# Altium schematic sheet CONNECTOR.SchDoc
size 420 x 297 mm; DocumentNumber: 3; SheetNumber: 3; SheetTotal: 17
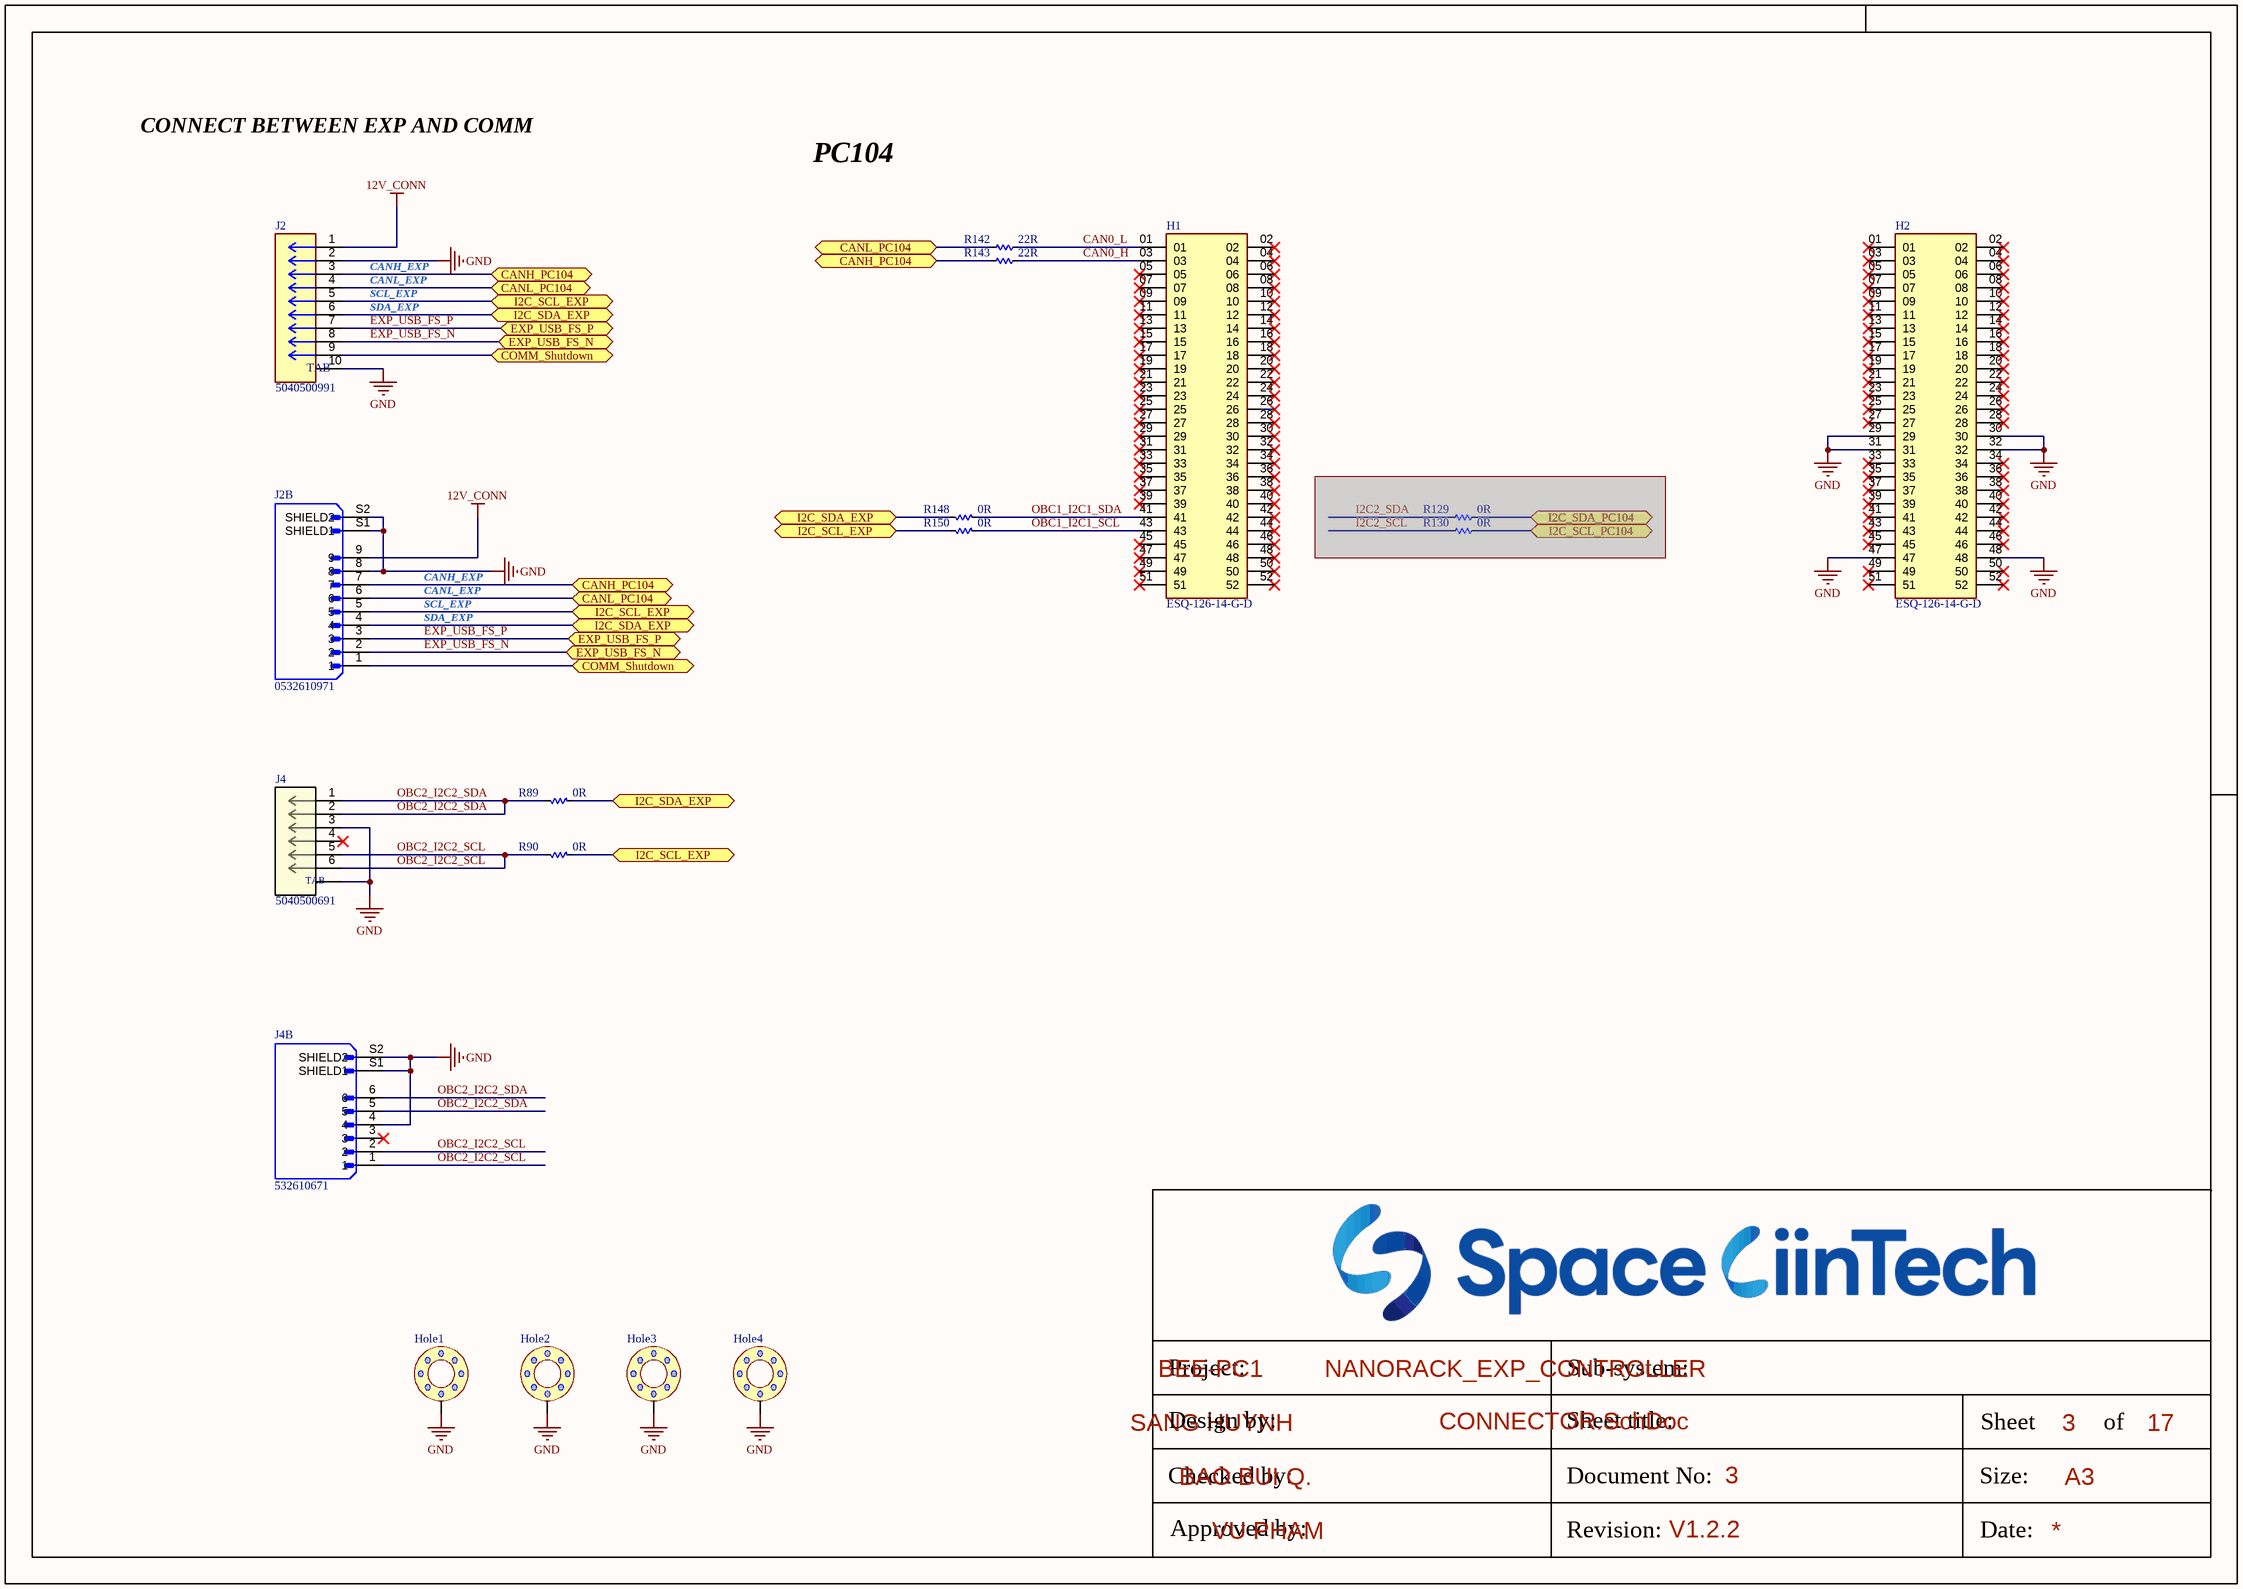
[diagram p0: CONNECTOR.SchDoc]

## Parts
H1  ESQ-126-14-G-D  [SAMTEC_ESQ-126-14-G-D]
H2  ESQ-126-14-G-D  [SAMTEC_ESQ-126-14-G-D]
Hole1  hole_space  [HOLE_SPACE]  (value not drawn)
Hole2  hole_space  [HOLE_SPACE]  (value not drawn)
Hole3  hole_space  [HOLE_SPACE]  (value not drawn)
Hole4  hole_space  [HOLE_SPACE]  (value not drawn)
J2  5040500991  [5040500991]
J2B  0532610971  [0532610971]
J4  5040500691  [5040500691]
J4B  532610671  [MOLEX_532610671]
R89  0R  [RES_C_1608X60]
R90  0R  [RES_C_1608X60]
R129  0R  [RES_C_1608X60]  (masked out: inside a compile mask, not in the netlist)
R130  0R  [RES_C_1608X60]  (masked out: inside a compile mask, not in the netlist)
R142  22R  [RES_C_1608X60]
R143  22R  [RES_C_1608X60]
R148  0R  [RES_C_1608X60]
R150  0R  [RES_C_1608X60]

## Ports
CANH_PC104 (bidir), CANL_PC104 (bidir), COMM_Shutdown (bidir), EXP_USB_FS_N (bidir), EXP_USB_FS_P (bidir), I2C_SCL_EXP (bidir), I2C_SCL_PC104 (bidir), I2C_SDA_EXP (bidir), I2C_SDA_PC104 (bidir)

## Nets
12V_CONN: J2.1 J2B.9
GND: H2.29 H2.30 H2.31 H2.32 H2.47 H2.48 Hole1.1 Hole2.1 Hole3.1 Hole4.1 J2.2 J2.10 J2B.8 J2B.S1(SHIELD1) J2B.S2(SHIELD2) J4.3 J4.7 J4B.4 J4B.S1(SHIELD1) J4B.S2(SHIELD2)
CAN0_H: H1.03 R143.2
CAN0_L: H1.01 R142.2
CANH_PC104: J2.3 J2B.7 R143.1 ; port CANH_PC104
CANL_PC104: J2.4 J2B.6 R142.1 ; port CANL_PC104
COMM_Shutdown: J2.9 J2B.1 ; port COMM_Shutdown
EXP_USB_FS_N: J2.8 J2B.2 ; port EXP_USB_FS_N
EXP_USB_FS_P: J2.7 J2B.3 ; port EXP_USB_FS_P
I2C_SCL_EXP: J2.5 J2B.5 R90.1 R150.2 ; port I2C_SCL_EXP
I2C_SDA_EXP: J2.6 J2B.4 R89.1 R148.2 ; port I2C_SDA_EXP
OBC1_I2C1_SCL: H1.43 R150.1
OBC1_I2C1_SDA: H1.41 R148.1
OBC2_I2C2_SCL: J4.5 J4.6 J4B.1 J4B.2 R90.2
OBC2_I2C2_SDA: J4.1 J4.2 J4B.5 J4B.6 R89.2

Not connected (* = marked no-connect by the designer): H1 02* 04* 05* 06* 07* 08* 09* 10* 11* 12* 13* 14* 15* 16* 17* 18* 19* 20* 21* 22* 23* 24* 25* 26* 27* 28* 29* 30* 31* 32* 33* 34* 35* 36* 37* 38* 39* 40* 42* 44* 45* 46* 47* 48* 49* 50* 51* 52*; H2 01* 02* 03* 04* 05* 06* 07* 08* 09* 10* 11* 12* 13* 14* 15* 16* 17* 18* 19* 20* 21* 22* 23* 24* 25* 26* 27* 28* 33* 34* 35* 36* 37* 38* 39* 40* 41* 42* 43* 44* 45* 46* 49* 50* 51* 52*; J4 4*; J4B 3*

## Notes on the sheet
- CONNECT BETWEEN EXP AND COMM
- PC104
- CANL_EXP
- CANH_EXP
- SCL_EXP
- SDA_EXP
- Project:
- BEE-PC1
- Sub-system:
- NANORACK_EXP_CONTROLLER
- Design by:
- SANG HUYNH
- BAO BUI Q.
- Sheet title:
- Sheet
- A3
- of
- Checked by:
- Approved by:
- VU PHAM
- Revision:
- Document No:
- V1.2.2
- Size:
- Date:
- (in symbol 5040500691) TAB
- (in symbol 5040500991) TAB

## Library data of the parts
H1 H2 = ESQ-126-14-G-D: MF: Samtec; MP: ESQ-126-14-G-D; Price: None; Package: None; Value: *; Availability: Unavailable
J2 = 5040500991: Connector Header Surface Mount, Right Angle 9 position 0.059" (1.50mm)
J2B = CONN_SMD_09: CONN HEADER SMD R/A 9POS 1.25MM
J4 = 5040500691: 1.50mm Pitch, Pico-Lock PCB Header, Single Row, Right-Angle, Surface Mount, Gold (Au) Plating, Positive Lock, 6 Circuits, Tape and Reel; Manufacturer_Name: Molex Connector Corporation; Copyright: Copyright (C) 2025 Ultra Librarian. All rights reserved.; Manufacturer_Part_Number: 5040500691; Datasheet: https://www.molex.com/en-us/products/part-detail-pdf/5040500691?display=pdf; RefDes: RefDes; Type: Type
J4B = CONN_SMD_06: Value: *; Availability: Unavailable; Package: None; MP: 532610671; Price: None
R89 R90 R129 R130 R142 R143 R148 R150 = _RES_B_2: RES